# EAGLE schematic soldering_station (EAGLE 9.6.2)
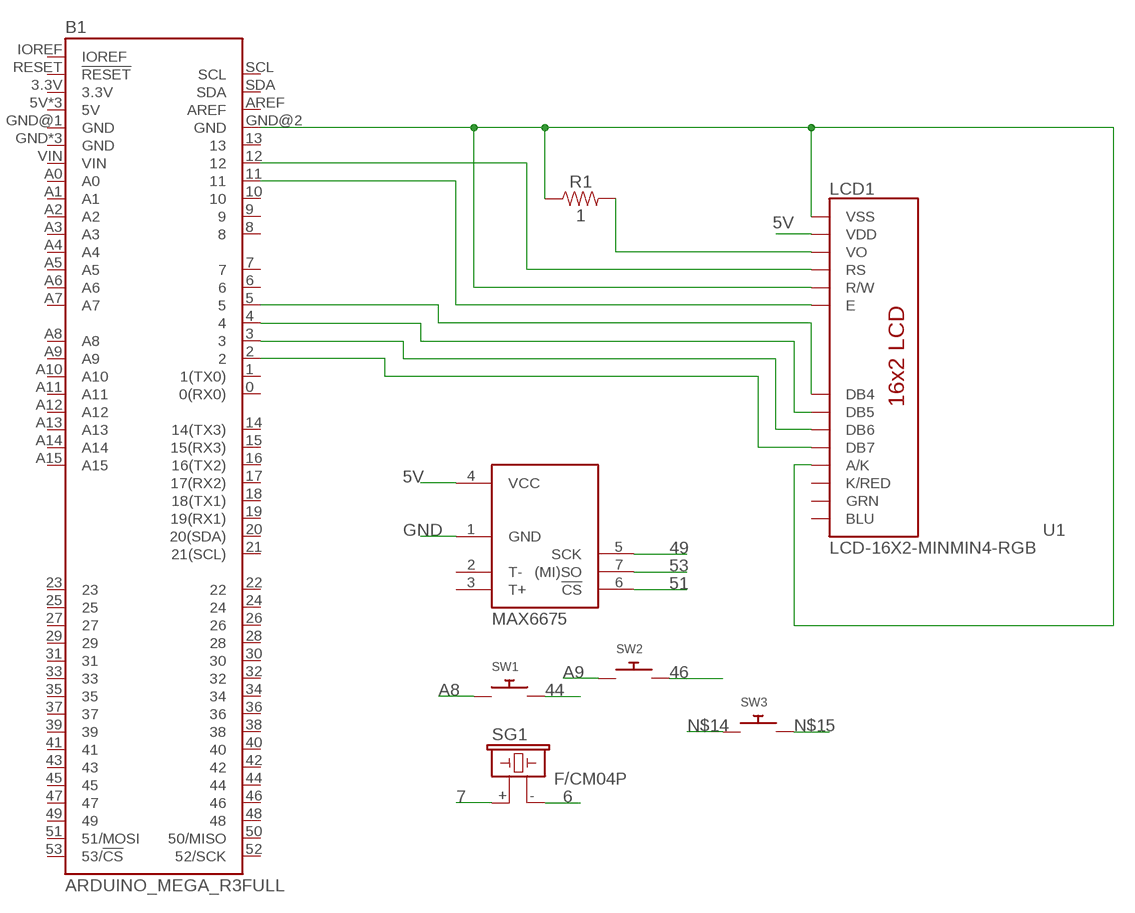
[diagram p0: schematic, sheet 1]

## Parts
B1  ARDUINO_MEGA_R3FULL  [ARDUINO_MEGA_NO_SILK]
LCD1  LCD-16X2-MINMIN4-RGB  [LCD-16X2_NOSILK-KIT-4BIT]
R1  1  1OHM-0603-1/10W-1%  [0603]
SG1  F/CM04P  [F/CM04P]
SW1  SWITCH_PUSHBUTTONSOFTTOUCHSMD_SJ  [PUSHBUTTON_SMD_SJ]
SW2  SWITCH_PUSHBUTTONSOFTTOUCHSMD_SJ  [PUSHBUTTON_SMD_SJ]
SW3  SWITCH_PUSHBUTTONSOFTTOUCHSMD_SJ  [PUSHBUTTON_SMD_SJ]
U1  MAX6675  [SOIC8]

## Nets
5V: LCD1.2(VDD) U1.4(VCC)
6: SG1.-
7: SG1.+
44: SW1.P$2
46: SW2.P$2
49: U1.5(SCK)
51: U1.6(!CS)
53: U1.7((MI)SO)
A8: SW1.P$1
A9: SW2.P$1
GND: U1.1(GND)
N$1: B1.GND@2(GND) LCD1.1(VSS) LCD1.5(R/W) LCD1.15(A/K) R1.1
N$3: LCD1.3(VO) R1.2
N$5: B1.12 LCD1.4(RS)
N$6: B1.11 LCD1.6(E)
N$7: B1.5 LCD1.11(DB4)
N$8: B1.4 LCD1.12(DB5)
N$9: B1.3 LCD1.13(DB6)
N$11: B1.2 LCD1.14(DB7)
N$14: SW3.P$1
N$15: SW3.P$2
Unconnected: B1.0(0(RX0)) B1.1(1(TX0)) B1.3.3V B1.5V B1.5V@1(5V) B1.5V@2(5V) B1.6 B1.7 B1.8 B1.9 B1.10 B1.13 B1.14(14(TX3)) B1.15(15(RX3)) B1.16(16(TX2)) B1.17(17(RX2)) B1.18(18(TX1)) B1.19(19(RX1)) B1.20(20(SDA)) B1.21(21(SCL)) B1.22 B1.23 B1.24 B1.25 B1.26 B1.27 B1.28 B1.29 B1.30 B1.31 B1.32 B1.33 B1.34 B1.35 B1.36 B1.37 B1.38 B1.39 B1.40 B1.41 B1.42 B1.43 B1.44 B1.45 B1.46 B1.47 B1.48 B1.49 B1.50(50/MISO) B1.51(51/MOSI) B1.52(52/SCK) B1.53(53/!CS) B1.A0 B1.A1 B1.A2 B1.A3 B1.A4 B1.A5 B1.A6 B1.A7 B1.A8 B1.A9 B1.A10 B1.A11 B1.A12 B1.A13 B1.A14 B1.A15 B1.AREF B1.GND B1.GND@1(GND) B1.GND@3(GND) B1.GND@4(GND) B1.IOREF B1.RESET(!RESET) B1.SCL B1.SDA B1.VIN U1.2(T-) U1.3(T+)

## Power pins joined to a net without a drawn wire
BLU: LCD1.18(BLU)
GRN: LCD1.17(GRN)
K/RED: LCD1.16(K/RED)

## Library data of the parts
B1 = SparkFun-Boards:ARDUINO_MEGA_R3: Arduino Mega R3 ATmega2560 R3 compatible footprint. SparkFun Products: Arduino Mega 2560 R3 <https://www.sparkfun.com/products/11061>
LCD1 = SparkFun-Displays:LCD-16X2-MIN: RGB 16x2 parallel input LCD, 4bit only Basic 16 character by 2 line display. Typically utilizes the extremely common HD44780 parallel interface chipset SparkFun Products: Basic 16x2 RGB <https://www.sparkfun.com/products/10862>; SF_ID: LCD-10862
R1 = SparkFun-Resistors:1OHM: 1Ω resistor A resistor is a passive two-terminal electrical component that implements electrical resistance as a circuit element. Resistors act to reduce current flow, and, at the same time, act to lower voltage levels within circuits. - Wikipedia; PROD_ID: RES-08269
SG1 = buzzer:F/CM04P: BUZZER Source: Buerklin; OC_FARNELL: unknown; OC_NEWARK: unknown
SW1-SW3 = adafruit:SWITCH_PUSHBUTTON: Buttons SOFTTOUCHSMD_SJ - Soft touch temporary push button (Super Junk Akihabara) Compatible with SKPMANE010 [Mouser: 688-SKPMAN] C&K_KSS = Digikey: KSS221GLFS
U1 = SparkFun-Retired:MAX6675: Cold-Junction-Compensated K-Thermocoupleto-Digital Converter (0°C to +1024°C) The MAX6675 performs cold-junction compensation and digitizes the signal from a type-K thermocouple. The data is output in a 12-bit resolution, SPI™-compatible, read-only format. This converter resolves temperatures to 0.25°C, allows readings as high as +1024°C, and exhibits thermocouple accuracy of 8LSBs for temperatures ranging from 0°C to +700°C. Dead Prototype: IC-12512; PROD_ID: IC-12512